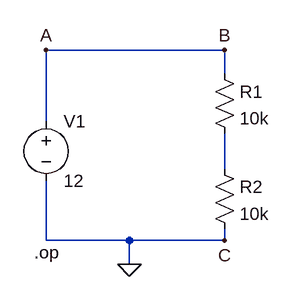
[diagram p0: schematic aula1.2.asc]
aula1.2.asc, the LTspice schematic file:
Version 4
SHEET 1 880 680
WIRE 352 32 112 32
WIRE 352 64 352 32
WIRE 112 128 112 32
WIRE 352 192 352 144
WIRE 112 288 112 208
WIRE 224 288 112 288
WIRE 352 288 352 272
WIRE 352 288 224 288
WIRE 224 320 224 288
FLAG 224 320 0
FLAG 112 32 A
FLAG 352 32 B
FLAG 352 288 C
SYMBOL voltage 112 112 R0
WINDOW 123 0 0 Left 0
WINDOW 39 0 0 Left 0
SYMATTR InstName V1
SYMATTR Value 12
SYMBOL res 336 48 R0
SYMATTR InstName R1
SYMATTR Value 10k
SYMBOL res 336 176 R0
SYMATTR InstName R2
SYMATTR Value 10k
TEXT 96 304 Left 2 !.op

The netlist it stands for:
* aula1.2.asc
V1 B 0 12
R1 B N001 10k
R2 N001 0 10k
.op
.backanno
.end